# EAGLE design pre-charger-v1.1 (EAGLE 7.7.0)
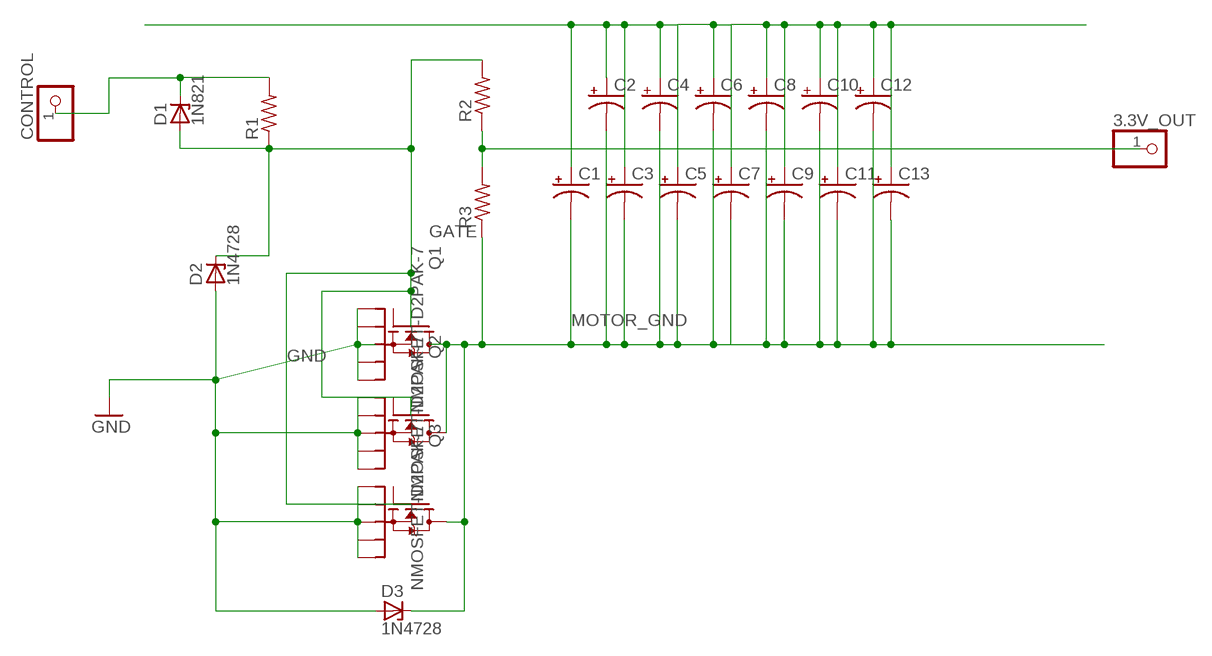
[diagram p0: schematic, sheet 1]

## Parts
3.3V_OUT  PINHD-1X1  [1X01]
C1  CPOL-USE3.5-8  [E3,5-8]
C2  CPOL-USE3.5-8  [E3,5-8]
C3  CPOL-USE3.5-8  [E3,5-8]
C4  CPOL-USE3.5-8  [E3,5-8]
C5  CPOL-USE3.5-8  [E3,5-8]
C6  CPOL-USE3.5-8  [E3,5-8]
C7  CPOL-USE3.5-8  [E3,5-8]
C8  CPOL-USE3.5-8  [E3,5-8]
C9  CPOL-USE3.5-8  [E3,5-8]
C10  CPOL-USE3.5-8  [E3,5-8]
C11  CPOL-USE3.5-8  [E3,5-8]
C12  CPOL-USE3.5-8  [E3,5-8]
C13  CPOL-USE3.5-8  [E3,5-8]
CONTROL  PINHD-1X1  [1X01]
D1  1N821  [DO35Z10]
D2  1N4728  [DO41Z10]
D3  1N4728  [DO41Z10]
Q1  NMOSFET-D2PAK-7  [D2PAK-7]
Q2  NMOSFET-D2PAK-7  [D2PAK-7]
Q3  NMOSFET-D2PAK-7  [D2PAK-7]
R1  R-US_0204/7  [0204/7]
R2  R-US_0204/7  [0204/7]
R3  R-US_0204/7  [0204/7]

## Nets
3.3V_OUT: 3.3V_OUT.1 R2.1 R3.2
GATE: D1.A D2.C R1.1 R2.2
GND: D2.A D3.A Q1.S1 Q1.S2 Q1.S3 Q1.S4 Q1.S5 Q2.S1 Q2.S5 Q3.S1 Q3.S5
MOTOR_GND: C1.- C2.- C3.- C4.- C5.- C6.- C7.- C8.- C9.- C10.- C11.- C12.- C13.- D3.C Q1.D Q2.D Q3.D R3.1
N$2: CONTROL.1 D1.C R1.2
V_BATT: C1.+ C2.+ C3.+ C4.+ C5.+ C6.+ C7.+ C8.+ C9.+ C10.+ C11.+ C12.+ C13.+
Unconnected: Q1.G Q2.G Q2.S2 Q2.S3 Q2.S4 Q3.G Q3.S2 Q3.S3 Q3.S4

## Library data of the parts
3.3V_OUT CONTROL = pinhead:PINHD-1X1: PIN HEADER
C1-C13 = rcl:CPOL-US: POLARIZED CAPACITOR, American symbol
D1 = diode:1N821: Reference DIODE temperature compensated, 6,2 V
D2 D3 = diode:1N4728: Z DIODE 3.3 V, 1W, 5 percent
Q1-Q3 = D2PAK-7:NMOSFET-D2PAK-7
R1-R3 = rcl:R-US_: RESISTOR, American symbol

## Board
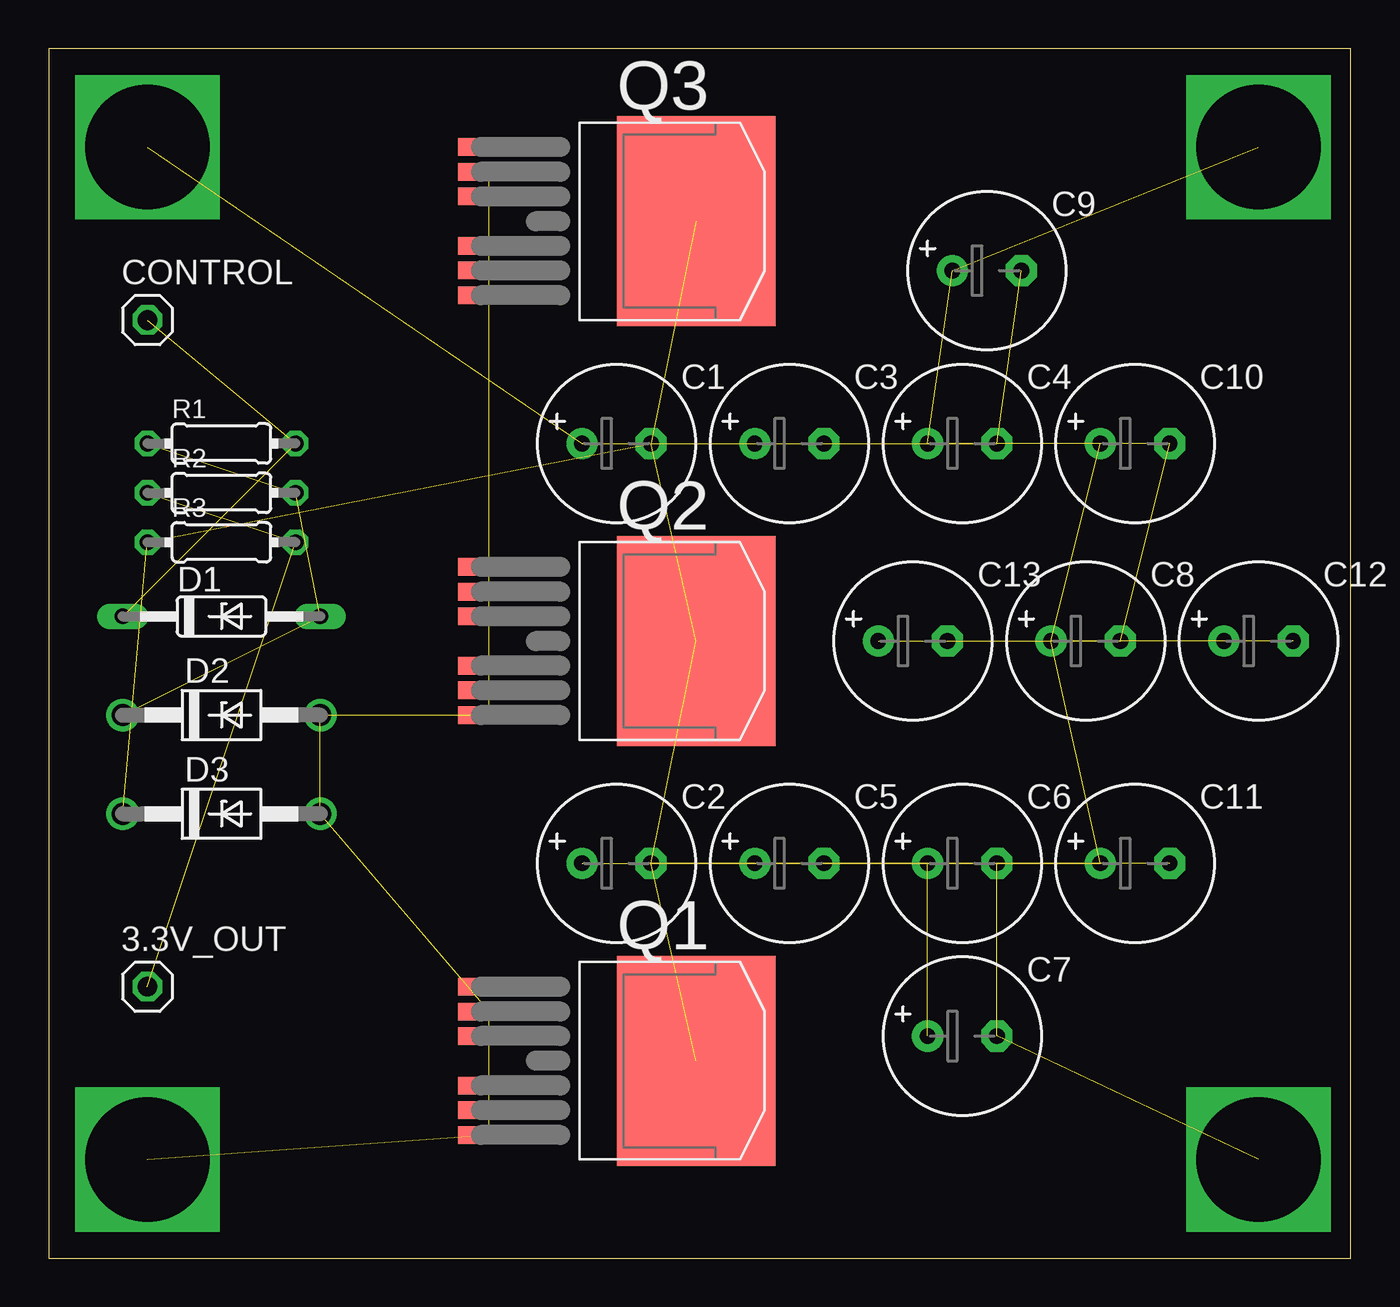
[diagram p1: board, top side]

Size 66.98 x 62.22 mm. Coordinates in mm from the lower left corner, seen from the top.
Outline: 0,0 66.98,0 66.98,62.22 0,62.22 0,0
Copper layers (1*16): Top 0.035mm / dielectric 1.5mm / Bottom 0.035mm
Design rules "default": minimum track width 10mil, minimum drill 24mil, track to track 8mil, track to pad 8mil, pad to pad 8mil, via to via 8mil, smd to smd 8mil, copper to edge 40mil, drill to drill 8mil, minimum pad ring 10mil, minimum via ring 8mil, stop-mask expansion 4mil, vias tented up to drill 0mil, thermal gap 10mil

### Footprints (pad centres in the part's own frame; a part is rotated, then mirrored left to right if it is on the bottom)
1X01 = drill 1.016 octagon: 1 0,0
E3,5-8 = drill 0.813 pad 1.6: + -1.778,0 | drill 0.813 pad 1.6 octagon: - 1.778,0
DO35Z10 = drill 0.813 long: A 5.08,0; C -5.08,0
DO41Z10 = drill 1.118: A 5.08,0; C -5.08,0
D2PAK-7 = smd 10.8 x 8.15: D 0,4.1 | smd 0.9 x 3.2: G -3.81,-6.56; S1 -2.54,-6.56; S2 -1.27,-6.56; S3 1.27,-6.56; S4 2.54,-6.56; S5 3.81,-6.56
0204/7 = drill 0.813 octagon: 1 -3.81,0; 2 3.81,0

### Placement (x,y rotation side)
3.3V_OUT  5.08,13.97 0 top
C1  29.21,41.91 0 top
C2  29.21,20.32 0 top
C3  38.1,41.91 0 top
C4  46.99,41.91 0 top
C5  38.1,20.32 0 top
C6  46.99,20.32 0 top
C7  46.99,11.43 0 top
C8  53.34,31.75 0 top
C9  48.26,50.8 0 top
C10  55.88,41.91 0 top
C11  55.88,20.32 0 top
C12  62.23,31.75 0 top
C13  44.45,31.75 0 top
CONTROL  5.08,48.26 0 top
D1  8.89,33.02 0 top
D2  8.89,27.94 0 top
D3  8.89,22.86 0 top
Q1  29.21,10.16 270 top
Q2  29.21,31.75 270 top
Q3  29.21,53.34 270 top
R1  8.89,41.91 0 top
R2  8.89,39.37 0 top
R3  8.89,36.83 0 top

### Tracks (layer width: path | path; a pad name or v marks a point on that pad's centre or on a via)
3.3V_OUT  (2 unrouted)
GATE  (3 unrouted)
GND  (via drill 6.4 pad 6.45)  (11 unrouted)
  other vias: 5.08,5.08
MOTOR_GND  (via drill 6.4 pad 6.45)  (18 unrouted)
  other vias: 62.23,5.08
N$2  (2 unrouted)
V_BATT  (via drill 6.4 pad 6.45)  (14 unrouted)
  other vias: 5.08,57.15 62.23,57.15